# Altium schematic sheet bh_rs485_0_alph.SchDoc
size A4
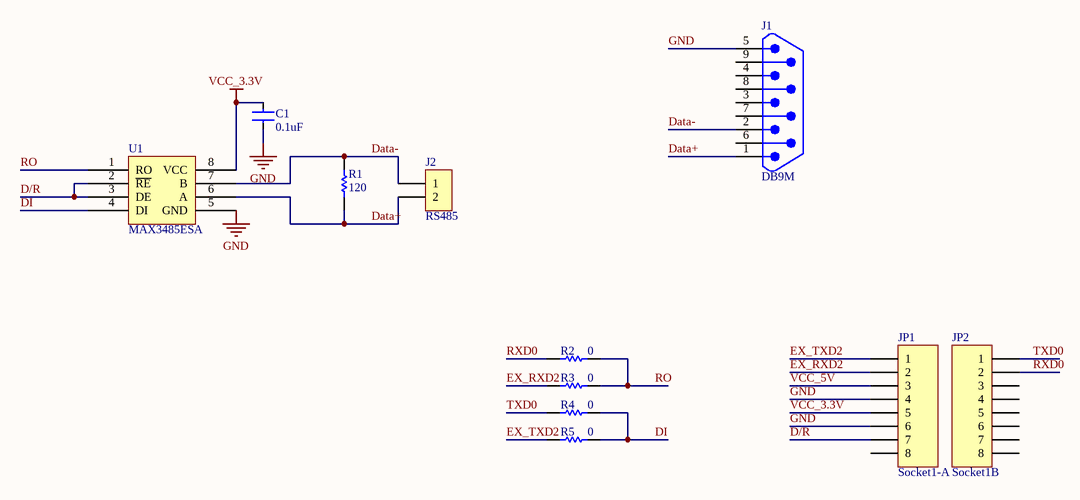
[diagram p0: bh_rs485_0_alph.SchDoc]

## Parts
C1  0.1uF  [C0603]
J1  DB9M  [DB9/M]
J2  RS485  [CON2*0.381]
JP1  Socket1-A  [SIP1x8x2.0]
JP2  Socket1B  [SIP1x8x2.0]
R1  120  [R0603]
R2  0  [R0603]
R3  0  [R0603]
R4  0  [R0603]
R5  0  [R0603]
U1  MAX3485ESA  [SO-8]

## Nets
GND: C1.2 J1.5 JP1.4 JP1.6 U1.5(GND)
VCC_3.3V: C1.1 JP1.5 U1.8(VCC)
D/R: JP1.7 U1.2(~{RE}) U1.3(DE)
Data+: J1.1 J2.2 R1.1 U1.6(A)
Data-: J1.2 J2.1 R1.2 U1.7(B)
DI: R4.1 R5.1 U1.4(DI)
EX_RXD2: JP1.2 R3.2
EX_TXD2: JP1.1 R5.2
RO: R2.1 R3.1 U1.1(RO)
RXD0: JP2.2 R2.2
TXD0: JP2.1 R4.2
VCC_5V: JP1.3

Not connected (* = marked no-connect by the designer): J1 3 4(2) 6(9) 7(8) 8(7) 9(6); JP1 8; JP2 3 4 5 6 7 8

## Library data of the parts
C1 = CAP-SMD: SMD-CAP; Value: 0.1uF
J1 = DB9M: jointbar
J2 = SIP1X2: Connector
JP1 = SIP1X8
JP2 = SIP1X8: 8 Pin Header
R1-R5 = RES: Resistor
  R1: Value: 120
  R2-R5: Value: 0
U1 = MAX3485ESA: X9511WP-10K